# Altium schematic sheet POWER_GEN.SchDoc: =project_title
size Tabloid; CompanyName: Luxonis Holding; Organization: Luxonis Holding; Address1: 1925 Harmony Park Drive; Address2: Westminster, CO; Address3: 80234; Address4: United States; SheetNumber: 11; SheetTotal: 13
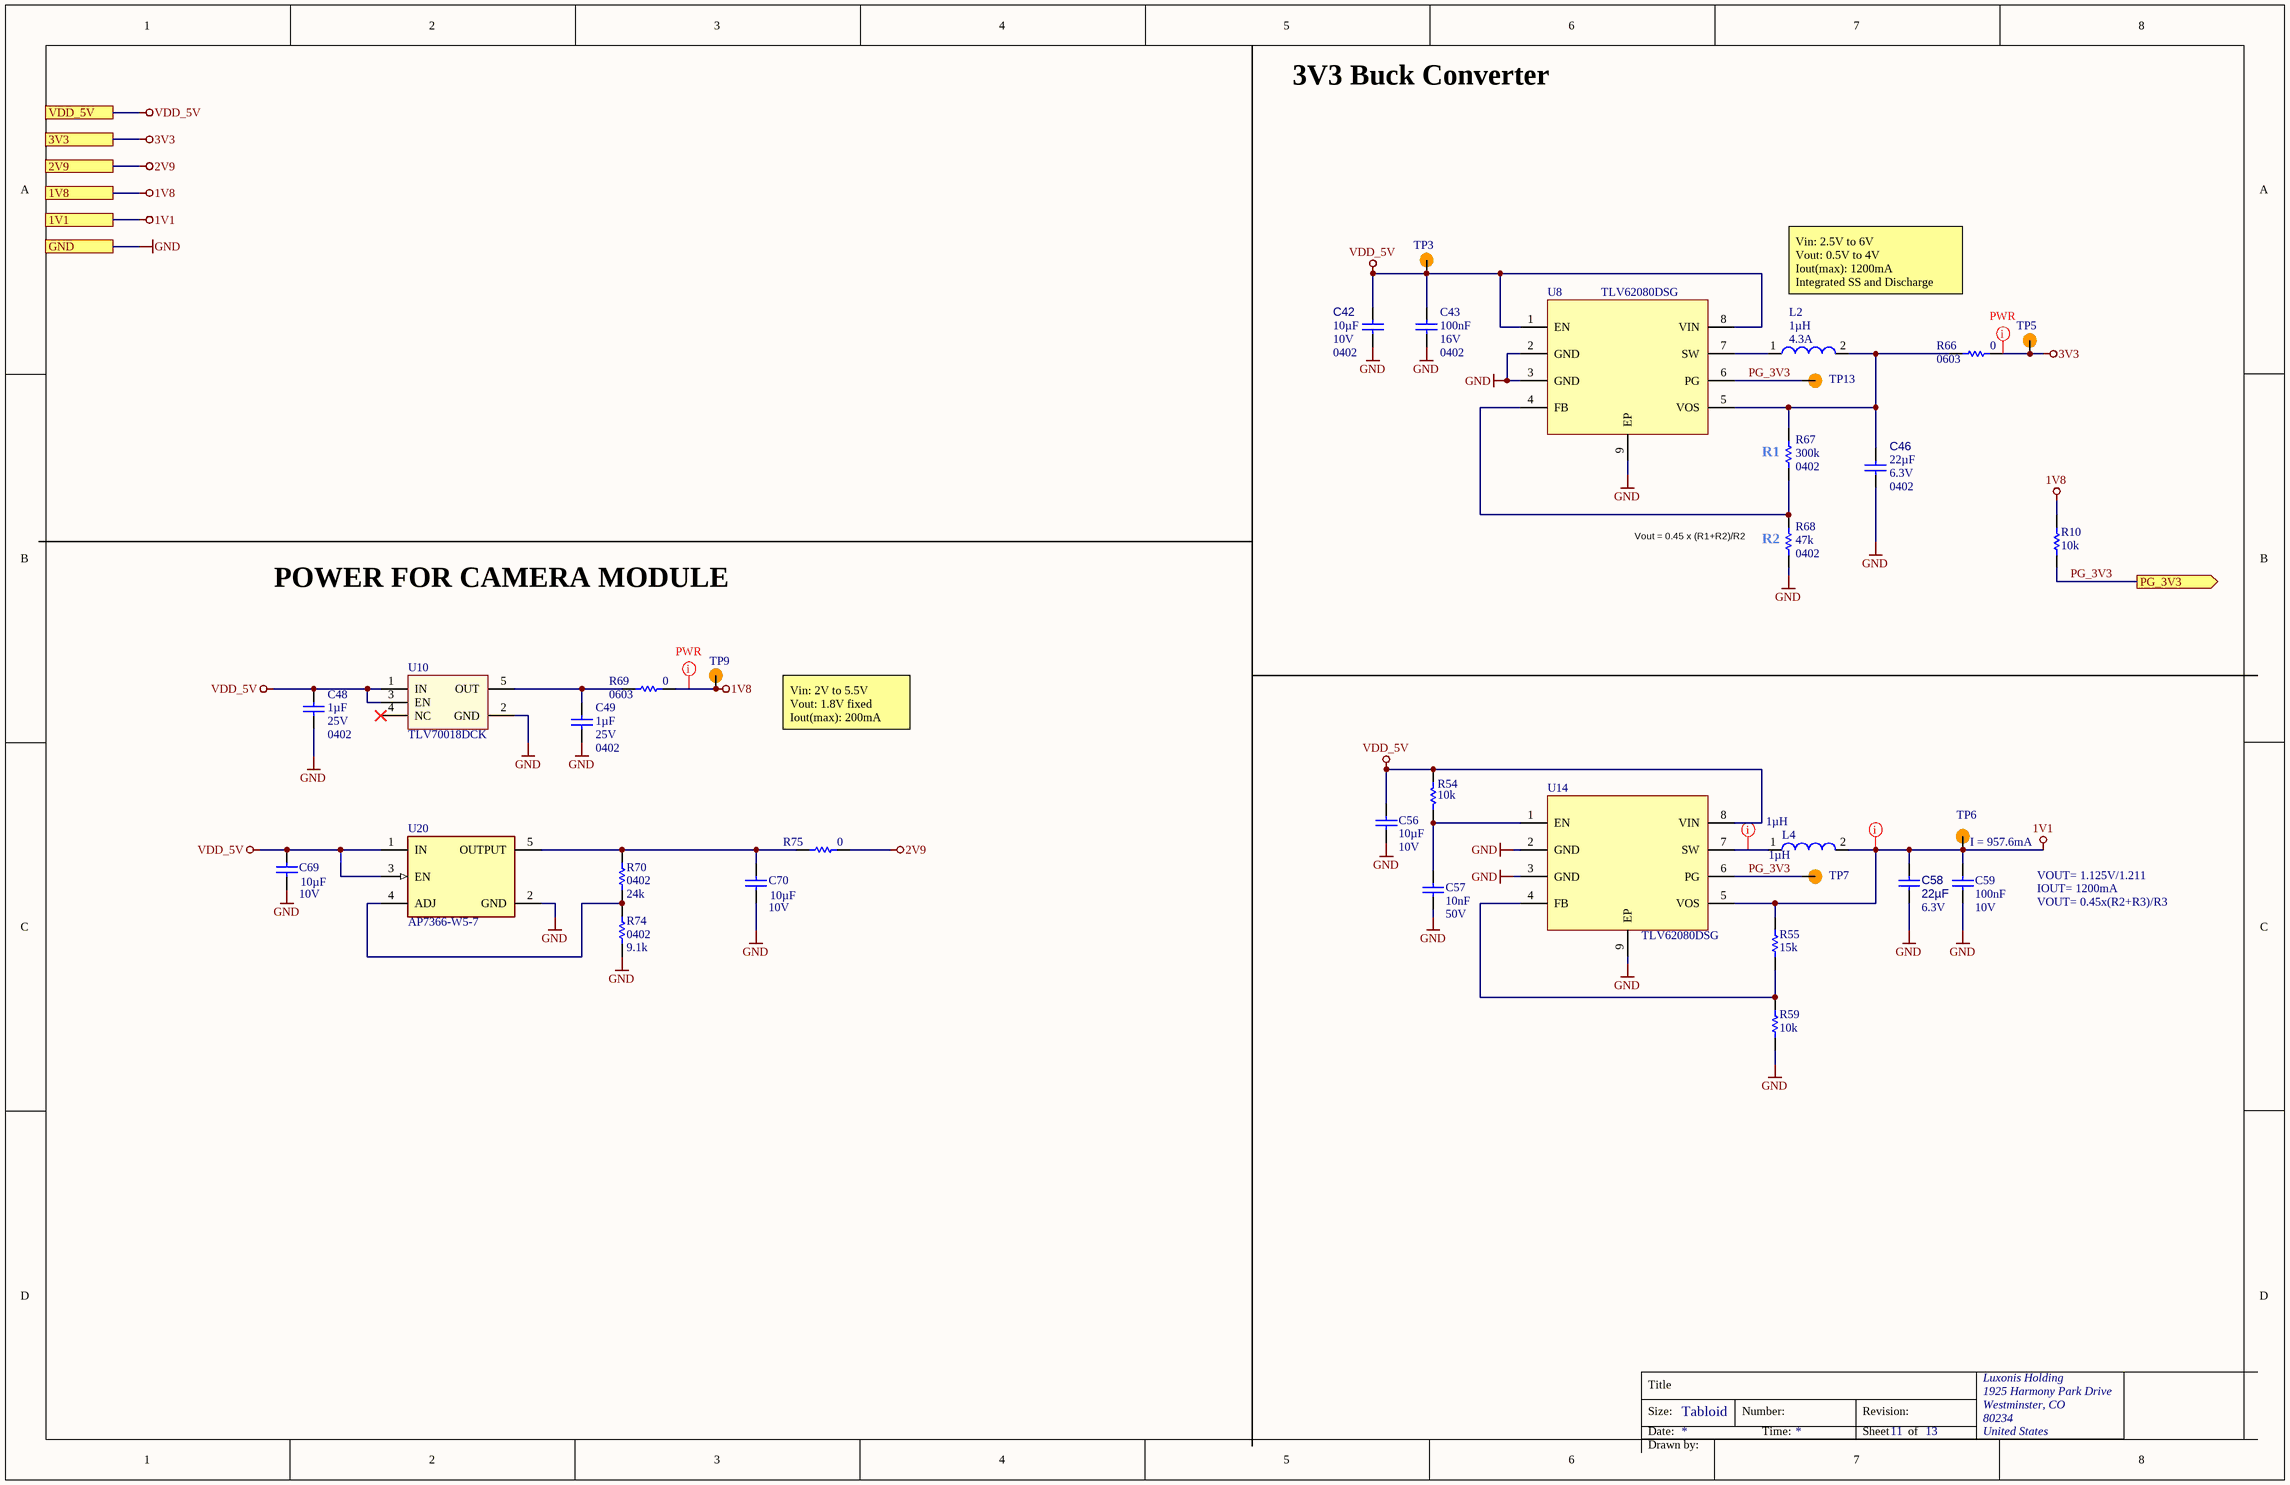
[diagram p0: POWER_GEN.SchDoc]

## Parts
C42  value 10µF  Voltage Rating: 10V  Case/Package: 0402  [CAPC0402(1005)60_L]  (hidden comment: GRM155R61A106ME11D)
C43  value 100nF  Voltage Rating: 16V  Case/Package: 0402  [CAPC0402(1005)60_N]  (hidden comment: CL05B104KO5NFNC)
C46  value 22µF  Voltage Rating: 6.3V  Case/Package: 0402  [CAPC0402(1005)60_L]  (hidden comment: CL05A226MQ5N6J8)
C48  value 1µF  Voltage Rating: 25V  Case/Package: 0402  [CAPC0402(1005)70_N]  (hidden comment: GRM155R61E105KA12D)
C49  value 1µF  Voltage Rating: 25V  Case/Package: 0402  [CAPC0402(1005)70_N]  (hidden comment: GRM155R61E105KA12D)
C56  10µF  Voltage Rating: 10V  [CAPC0603(1608)100_L]
C57  10nF  Voltage Rating: 50V  [CAPC0402(1005)60_L]
C58  22µF  Voltage Rating: 6.3V  [CAPC0402(1005)60_L]
C59  100nF  Voltage Rating: 10V  [CAPC0402(1005)70_L]
C69  value 10µF  Voltage Rating: 10V  [CAPC0603(1608)100_L]  (hidden comment: GRM188R61A106ME69D)
C70  value 10µF  Voltage Rating: 10V  [CAPC0603(1608)100_L]  (hidden comment: GRM188R61A106ME69D)
L2  value 1µH  Current Rating: 4.3A  [DFE252012P-1R0M=P2]  (hidden comment: DFE252012P-1R0M=P2)
L4  1µH  [DFE252012P-1R0M=P2]
R10  10k  [RESC0402(1005)_L]
R54  10k  [RESC0402(1005)_L]
R55  15k  [RESC0402(1005)_L]
R59  10k  [RESC0402(1005)_L]
R66  value 0  Case/Package: 0603  [RESC0603(1608)_N]  (hidden comment: CRCW06030000Z0EA)
R67  value 300k  Case/Package: 0402  [RESC0402(1005)_N]  (hidden comment: RC0402FR-07300KL)
R68  value 47k  Case/Package: 0402  [RESC0402(1005)_L]  (hidden comment: RC0402FR-0747KL)
R69  value 0  Case/Package: 0603  [RESC0603(1608)_N]  (hidden comment: CRCW06030000Z0EA)
R70  value 24k  Case/Package: 0402  [RESC0402(1005)_L]  (hidden comment: RC0402FR-0724KL)
R74  value 9.1k  Case/Package: 0402  [RESC0402(1005)_L]  (hidden comment: CRCW04029K10FKED)
R75  value 0  [RESC0603(1608)_N]  (hidden comment: CRCW06030000Z0EA)
TP3  TEST_POINT  [TP075_150_NS]  (value not drawn)  (no BOM)
TP5  TEST_POINT  [TP075_150_NS]  (value not drawn)  (no BOM)
TP6  TEST_POINT  [TP075_150_NS]  (value not drawn)  (no BOM)
TP7  TEST_POINT  [TP075_150_NS]  (value not drawn)  (no BOM)
TP9  TEST_POINT  [TP075_150_NS]  (value not drawn)  (no BOM)
TP13  TEST_POINT  [TP075_150_NS]  (value not drawn)  (no BOM)
U8  TLV62080DSG  [TLV62080DSG]
U10  TLV70018DCK  [TLV70018DCK]
U14  TLV62080DSG  [TLV62080DSG]
U20  AP7366-W5-7  [FP-SOT25-MFG]

## Ports
1V1, 1V8, 2V9, 3V3, GND, PG_3V3 (out), VDD_5V

## Nets
1V1: C58.2 C59.2 L4.2 R55.2 TP6.1 U14.5(VOS) ; port 1V1
1V8: R10.2 R69.2 TP9.1 ; port 1V8
2V9: R75.2 ; port 2V9
3V3: R66.2 TP5.1 ; port 3V3
GND: C42.1 C43.1 C46.1 C48.1 C49.1 C56.1 C57.1 C58.1 C59.1 C69.1 C70.1 R59.1 R68.1 R74.1 U8.2(GND) U8.3(GND) U8.9(EP) U10.2(GND) U14.2(GND) U14.3(GND) U14.9(EP) U20.2(GND) ; port GND
VDD_5V: C42.2 C43.2 C48.2 C56.2 C69.2 R54.2 TP3.1 U8.1(EN) U8.8(VIN) U10.1(IN) U10.3(EN) U14.8(VIN) U20.1(IN) U20.3(EN) ; port VDD_5V
PG_3V3: R10.1 TP7.1 TP13.1 U8.6(PG) U14.6(PG) ; port PG_3V3
NetC46_2: C46.2 L2.2 R66.1 R67.2 U8.5(VOS)
NetC49_2: C49.2 R69.1 U10.5(OUT)
NetC57_2: C57.2 R54.1 U14.1(EN)
NetC70_2: C70.2 R70.2 R75.1 U20.5(OUTPUT)
NetL2_1: L2.1 U8.7(SW)
NetL4_1: L4.1 U14.7(SW)
NetR55_1: R55.1 R59.2 U14.4(FB)
NetR67_1: R67.1 R68.2 U8.4(FB)
NetR70_1: R70.1 R74.2 U20.4(ADJ)

Not connected (* = marked no-connect by the designer): U10 4(NC)*

## Layout directives
net class PWR; Current Rating: 1200mA: 3V3
net class Power_trace: 1V1, NetL4_1
net class PWR; Current Rating: 300mA: 1V8

## Notes on the sheet
- 3V3 Buck Converter
- Vin: 2.5V to 6V
  Vout: 0.5V to 4V
  Iout(max): 1200mA
  Integrated SS and Discharge
- (near R67) R1
- (near R68) Vout = 0.45 x (R1+R2)/R2
- (near R68) R2
- POWER FOR CAMERA MODULE
- Vin: 2V to 5.5V
  Vout: 1.8V fixed
  Iout(max): 200mA
- (near TP6) I = 957.6mA
- VOUT= 1.125V/1.211
- IOUT= 1200mA
- VOUT= 0.45x(R2+R3)/R3
- Title
- Size:
- Date:
- Tabloid
- Number:
- Time:
- Revision:
- Sheet
- of
- Drawn by:

## Library data of the parts
C42 = CMP-001-00125-4: CAP CER 10UF 10V X5R 0402 20%; Manufacturer 1: Murata; Mounting Technology: SMT; Tolerance: 20%; Manufacturer Part Number 1: GRM155R61A106ME11D; Dielectric: X5R
C43 = CMP-108-000002-6: CAP CER 0.1UF 16V X7R 0402 10%; Manufacturer 1: Samsung; ComponentLink1URL: https://datasheet.ciiva.com/25767/cl05b104ko5nfnc-25767124.pdf?src-supplier=Digi-Key; Length: 1mm; Design Item ID: CL05B104KO5NFNC; Tolerance: 10%; Min Operating Temperature: -55°C; Width: 0.02inch; Dielectric: X7R; ComponentLink1Description: https://datasheet.ciiva.com/25767/cl05b104ko5nfnc-25767124.pdf?src-supplier=Digi-Key; Height: 0.5mm; Depth: 0.5mm; Manufacturer Part Number 1: CL05B104KO5NFNC; Max Operating Temperature: 125°C; Mounting Technology: SMT
C46 = CMP-001-00163-4: CAP CER 22UF 6.3V X5R 0402 20%; Manufacturer 1: Samsung; Manufacturer Part Number 1: CL05A226MQ5N6J8; Mounting Technology: Surface Mount; Tolerance: 20%
C48 C49 = CMP-108-000014-5: CAP CER 1UF 25V X5R 0402 10%; Manufacturer 1: Murata; ComponentLink2Description: https://datasheet.ciiva.com/7719/1666664-7719006.pdf?src-supplier=Element14; ComponentLink2URL: https://datasheet.ciiva.com/7719/1666664-7719006.pdf?src-supplier=Element14; Max Operating Temperature: 85°C; Depth: 0.5mm; Mounting Technology: SMT; ComponentLink1URL: https://datasheet.ciiva.com/22732/1666664-22732122.pdf?src-supplier=Element14; Length: 1mm; ComponentLink1Description: https://datasheet.ciiva.com/22732/1666664-22732122.pdf?src-supplier=Element14; Manufacturer Part Number 1: GRM155R61E105KA12D; Tolerance: 10%; Design Item ID: GRM155R61E105KA12D; Dielectric: X5R; Min Operating Temperature: -55°C; Height: 0.5mm; Width: 0.5mm
C56 = CMP-004-000018-4: CAP CER 10UF 10V X5R 0603 20%; Manufacturer 1: Murata; Manufacturer Part Number 1: GRM188R61A106ME69D; Case/Package: 0603; Min Operating Temperature: -55°C; Max Operating Temperature: 85°C; Tolerance: 20%; Dielectric: X5R; Length: 1.6mm; Height: 0.8mm; Width: 0.8mm; Depth: 0.8mm; ComponentLink1URL: http://www.mouser.com/ds/2/281/c02e-2905.pdf?src-supplier=Mouser; ComponentLink1Description: http://www.mouser.com/ds/2/281/c02e-2905.pdf?src-supplier=Mouser; ComponentLink2URL: http://components.arrow.com/part/dataview/0323_06119472?src-supplier=Arrow+Europe; ComponentLink2Description: http://components.arrow.com/part/dataview/0323_06119472?src-supplier=Arrow+Europe; ComponentLink3URL: http://www.farnell.com/datasheets/2048014.pdf?src-supplier=Farnell; ComponentLink3Description: http://www.farnell.com/datasheets/2048014.pdf?src-supplier=Farnell; ComponentLink4URL: http://www.farnell.com/datasheets/1872210.pdf?src-supplier=Farnell; ComponentLink4Description: http://www.farnell.com/datasheets/1872210.pdf?src-supplier=Farnell; ComponentLink5URL: http://search.murata.co.jp/Ceramy/image/img/A01X/G101/ENG/GRM188R61A106ME69-01.pdf?src-supplier=Digi-Key; ComponentLink5Description: http://search.murata.co.jp/Ceramy/image/img/A01X/G101/ENG/GRM188R61A106ME69-01.pdf?src-supplier=Digi-Key; ComponentLink6URL: http://www.farnell.com/datasheets/1872210.pdf?src-supplier=Newark; ComponentLink6Description: http://www.farnell.com/datasheets/1872210.pdf?src-supplier=Newark; ComponentLink7URL: http://www.farnell.com/datasheets/2048014.pdf?src-supplier=Element14; ComponentLink7Description: http://www.farnell.com/datasheets/2048014.pdf?src-supplier=Element14; ComponentLink8URL: http://www.farnell.com/datasheets/2048014.pdf?src-supplier=Newark; ComponentLink8Description: http://www.farnell.com/datasheets/2048014.pdf?src-supplier=Newark; Design Item ID: GRM188R61A106ME69D; Mounting Technology: SMT; Value: 10µF
C57 = CMP-108-000016-6: CAP CER 10000PF 50V X7R 0402 10%; Manufacturer 1: Murata; Manufacturer Part Number 1: GRM155R71H103KA88D; Case/Package: 0402; Min Operating Temperature: -55°C; Max Operating Temperature: 125°C; Tolerance: 10%; Dielectric: X7R; Length: 1mm; Height: 0.5mm; Width: 0.02inch; Depth: 0.5mm; ComponentLink1URL: https://datasheet.ciiva.com/129/product-129810.pdf?src-supplier=Digi-Key; ComponentLink1Description: https://datasheet.ciiva.com/129/product-129810.pdf?src-supplier=Digi-Key; ComponentLink2URL: https://datasheet.ciiva.com/19476/1856433-19476546.pdf?src-supplier=Jameco; ComponentLink2Description: https://datasheet.ciiva.com/19476/1856433-19476546.pdf?src-supplier=Jameco; ComponentLink3URL: https://datasheet.ciiva.com/11786/0900766b80ef921d-11786340.pdf?src-supplier=RSComponents; ComponentLink3Description: https://datasheet.ciiva.com/11786/0900766b80ef921d-11786340.pdf?src-supplier=RSComponents; ComponentLink4URL: https://datasheet.ciiva.com/18100/getdatasheetpartid-27434-18100660.pdf?src-supplier=Verical; ComponentLink4Description: https://datasheet.ciiva.com/18100/getdatasheetpartid-27434-18100660.pdf?src-supplier=Verical; ComponentLink5URL: https://datasheet.ciiva.com/22698/1747449-22698420.pdf?src-supplier=Element14; ComponentLink5Description: https://datasheet.ciiva.com/22698/1747449-22698420.pdf?src-supplier=Element14; ComponentLink6URL: https://datasheet.ciiva.com/29199/454225-da-01-en-vs-kondensator-0402-29199740.pdf?src-supplier=Conrad; ComponentLink6Description: https://datasheet.ciiva.com/29199/454225-da-01-en-vs-kondensator-0402-29199740.pdf?src-supplier=Conrad; ComponentLink7URL: https://datasheet.ciiva.com/129/grm155r71h103ka88-01-129811.pdf?src-supplier=Digi-Key; ComponentLink7Description: https://datasheet.ciiva.com/129/grm155r71h103ka88-01-129811.pdf?src-supplier=Digi-Key; ComponentLink8URL: https://datasheet.ciiva.com/129/grm155r71h103ka88-01-129812.pdf?src-supplier=Digi-Key; ComponentLink8Description: https://datasheet.ciiva.com/129/grm155r71h103ka88-01-129812.pdf?src-supplier=Digi-Key; ComponentLink9URL: https://datasheet.ciiva.com/16495/product-16495290.pdf?src-supplier=Future+Electronics; ComponentLink9Description: https://datasheet.ciiva.com/16495/product-16495290.pdf?src-supplier=Future+Electronics; ComponentLink10URL: https://datasheet.ciiva.com/5410/product-5410990.pdf?src-supplier=Mouser; ComponentLink10Description: https://datasheet.ciiva.com/5410/product-5410990.pdf?src-supplier=Mouser; Design Item ID: GRM155R71H103KA88D; Mounting Technology: SMT; Value: 10nF
C58 = CMP-001-00163-4: CAP CER 22UF 6.3V X5R 0402 20%; Manufacturer 1: Samsung; Manufacturer Part Number 1: CL05A226MQ5N6J8; Case/Package: 0402; Tolerance: 20%; Mounting Technology: Surface Mount; Value: 22µF
C59 = CMP-108-000015-5: CAP CER 0.1UF 10V X7R 0402 5%; Manufacturer 1: Murata; Manufacturer Part Number 1: GRM155R71A104JA01D; Case/Package: 0402; Min Operating Temperature: -55°C; Max Operating Temperature: 125°C; Tolerance: 5%; Dielectric: X7R; Length: 1mm; Height: 0.5mm; Width: 0.02inch; Depth: 0.5mm; ComponentLink1URL: https://datasheet.ciiva.com/5411/product-5411135.pdf?src-supplier=Mouser; ComponentLink1Description: https://datasheet.ciiva.com/5411/product-5411135.pdf?src-supplier=Mouser; ComponentLink2URL: https://datasheet.ciiva.com/11618/c02e-11618821.pdf?src-supplier=Avnet; ComponentLink2Description: https://datasheet.ciiva.com/11618/c02e-11618821.pdf?src-supplier=Avnet; Design Item ID: GRM155R71A104JA01D; Mounting Technology: SMT; Value: 100nF
C69 C70 = CMP-004-000018-4: CAP CER 10UF 10V X5R 0603 20%; Manufacturer 1: Murata; Manufacturer Part Number 1: GRM188R61A106ME69D; Case/Package: 0603; Min Operating Temperature: -55°C; Max Operating Temperature: 85°C; Tolerance: 20%; Dielectric: X5R; Length: 1.6mm; Height: 0.8mm; Width: 0.8mm; Depth: 0.8mm; ComponentLink1URL: http://www.mouser.com/ds/2/281/c02e-2905.pdf?src-supplier=Mouser; ComponentLink1Description: http://www.mouser.com/ds/2/281/c02e-2905.pdf?src-supplier=Mouser; ComponentLink2URL: http://components.arrow.com/part/dataview/0323_06119472?src-supplier=Arrow+Europe; ComponentLink2Description: http://components.arrow.com/part/dataview/0323_06119472?src-supplier=Arrow+Europe; ComponentLink3URL: http://www.farnell.com/datasheets/2048014.pdf?src-supplier=Farnell; ComponentLink3Description: http://www.farnell.com/datasheets/2048014.pdf?src-supplier=Farnell; ComponentLink4URL: http://www.farnell.com/datasheets/1872210.pdf?src-supplier=Farnell; ComponentLink4Description: http://www.farnell.com/datasheets/1872210.pdf?src-supplier=Farnell; ComponentLink5URL: http://search.murata.co.jp/Ceramy/image/img/A01X/G101/ENG/GRM188R61A106ME69-01.pdf?src-supplier=Digi-Key; ComponentLink5Description: http://search.murata.co.jp/Ceramy/image/img/A01X/G101/ENG/GRM188R61A106ME69-01.pdf?src-supplier=Digi-Key; ComponentLink6URL: http://www.farnell.com/datasheets/1872210.pdf?src-supplier=Newark; ComponentLink6Description: http://www.farnell.com/datasheets/1872210.pdf?src-supplier=Newark; ComponentLink7URL: http://www.farnell.com/datasheets/2048014.pdf?src-supplier=Element14; ComponentLink7Description: http://www.farnell.com/datasheets/2048014.pdf?src-supplier=Element14; ComponentLink8URL: http://www.farnell.com/datasheets/2048014.pdf?src-supplier=Newark; ComponentLink8Description: http://www.farnell.com/datasheets/2048014.pdf?src-supplier=Newark; Design Item ID: GRM188R61A106ME69D; Mounting Technology: SMT
L2 = CMP-082-000001-2: FIXED IND 1UH 3.2A 42 MOHM SMD; Manufacturer: Murata; Tolerance: 20%; Manufacturer Part Number: DFE252012P-1R0M=P2; Case/Package: 1008; Manufacturer 1: Murata; Manufacturer Part Number 1: DFE252012P-1R0M=P2; Manufacturer 2: Murata; Manufacturer Part Number 2: DFE252012P-1R0M=P2; Manufacturer 3: Murata; Manufacturer Part Number 3: DFE252012P-1R0M=P2; Manufacturer 4: Murata; Manufacturer Part Number 4: DFE252012P-1R0M=P2
L4 = CMP-082-000001-2: FIXED IND 1UH 3.2A 42 MOHM SMD; Manufacturer 1: Murata; Current Rating: 4.3A; Tolerance: 20%; Case/Package: 1008; Manufacturer Part Number 1: DFE252012P-1R0M=P2; Manufacturer 2: Murata; Manufacturer Part Number 2: DFE252012P-1R0M=P2; Manufacturer 3: Murata; Manufacturer Part Number 3: DFE252012P-1R0M=P2; Manufacturer 4: Murata; Manufacturer Part Number 4: DFE252012P-1R0M=P2; Manufacturer: Murata; Manufacturer Part Number: DFE252012P-1R0M=P2; Value: 1µH
R10 R54 R59 = CMP-115-000004-8: RES SMD 10K OHM 1% 1/16W 0402; Manufacturer 1: Yageo; Manufacturer Part Number 1: RC0402FR-1310KL; Temperature Coefficient: 100ppm/°C; Power Rating: 62.5mW; Voltage Rating: 50V; Case/Package: 0402; Min Operating Temperature: -55°C; Max Operating Temperature: 155°C; Tolerance: 1%; Design Item ID: RC0402FR-1310KL; Value: 10k
R55 = CMP-013-000009-9: RES SMD 15K OHM 1% 1/16W 0402; Manufacturer 1: Yageo; Manufacturer Part Number 1: RC0402FR-0715KL; Power Rating: 62.5mW; Voltage Rating: 50V; Case/Package: 0402; Min Operating Temperature: -55°C; Max Operating Temperature: 155°C; Tolerance: 1%; Design Item ID: RC0402FR-0715KL; Value: 15k
R66 R69 R75 = CMP-115-000011-7: RES SMD 0 OHM 5% 1/10W 0603; Manufacturer 1: Vishay; Manufacturer Part Number 1: CRCW0603-0000Z0EA; Temperature Coefficient: 100ppm/°C; Power Rating: 100mW; Voltage Rating: 75V; Tolerance: 5%; Design Item ID: CRCW06030000Z0EA; Max Operating Temperature: 155°C; Min Operating Temperature: -55°C
  R75: Case/Package: 0603
R67 = CMP-013-000049-8: RES SMD 300K OHM 1% 1/16W 0402; Manufacturer 1: Yageo; Voltage Rating: 50V; Power Rating: 63mW; Tolerance: 1%; Design Item ID: RC0402FR-07300KL; Max Operating Temperature: 155°C; Manufacturer Part Number 1: RC0402FR-07300KL; Min Operating Temperature: -55°C
R68 = CMP-013-000015-9: RES SMD 47K OHM 1% 1/16W 0402; Manufacturer 1: Yageo; Power Rating: 62.5mW; Voltage Rating: 50V; Max Operating Temperature: 155°C; Tolerance: 1%; Min Operating Temperature: -55°C; Manufacturer Part Number 1: RC0402FR-0747KL; Design Item ID: RC0402FR-0747KL
R70 = CMP-009-00213-16: RES SMD 24K OHM 1% 1/16W 0402; Manufacturer 1: YAGEO; Power Rating: 62.5mW; Manufacturer Part Number 1: RC0402FR-0724KL; Tolerance: 1%
R74 = CMP-00048-2: RES SMD 9.1K OHM 1% 1/16W 0402; Manufacturer 1: Vishay; Temperature Coefficient: 100ppm/°C; Package Width: 0.5mm; Power: 63mW; Package Length: 1mm; Reference Standard: AEC-Q200; Package Height: 0.35mm; Rated Temperature: 70°C; Working Voltage: 50V; Resistor Type: FIXED RESISTOR; Min Operating Temperature: -55°C; Reach SVHC Compliant: Yes; Max Operating Temperature: 155°C; Package Style: SMTMeter; Packaging: Tape and Reel; JESD-609 Code: e3; Mounting Technology: Surface Mount; Terminal Finish: Nickel; Construction: Chip; Manufacturer Part Number 1: CRCW04029K10FKED; Tolerance: 1%; Package Shape: Rectangular; Technology: METAL GLAZE/THICK FILM; Pins: 2; RoHS Compliant: Yes; Termination: Wraparound
TP3 TP5-TP7 TP9 TP13 = CMP-015-000000-5: Manufacturer Part Number 1: /; Design Item ID: TEST_POINT; Source: LuxonisMaster.SchLib
U8 = CMP-010-000007-4: IC REG BUCK ADJ 1.2A SYNC 8WSON; Manufacturer Part Number 1: TLV62080DSGR; Manufacturer 1: Texas Instruments; Output Voltage: 4V; Min Output Voltage: 500mV; Max Supply Voltage: 5.5V; Min Supply Voltage: 2.5V; Vfb/Vout: 450mV; Max Input Voltage: 6V; Max Output Current: 1.2A; Max Operating Temperature: 125°C; Max Output Voltage: 4V; Min Operating Temperature: -40°C; Min Input Voltage: 2.5V
U10 = CMP-113-000003-2: IC REG LINEAR 1.8V 200MA SC70-5 Linear Voltage Regulator IC  1 Output  200mA SC-70-5; Manufacturer 1: Texas Instruments; Manufacturer Part Number 1: TLV70018DCKR; Max Supply Voltage: 5.5V; Min Supply Voltage: 2V; Min Operating Temperature: -40°C; Pins: 5; Max Output Voltage: 1.8V; Max Operating Temperature: 125°C; Case/Package: SC; Max Output Current: 200mA; Min Output Voltage: 1.8V
U14 = CMP-010-000007-4: IC REG BUCK ADJ 1.2A SYNC 8WSON; Manufacturer 1: Texas Instruments; Manufacturer Part Number 1: TLV62080DSGR; Output Voltage: 4V; Min Supply Voltage: 2.5V; Min Output Voltage: 500mV; Max Supply Voltage: 5.5V; Vfb/Vout: 450mV; Max Input Voltage: 6V; Min Operating Temperature: -40°C; Max Operating Temperature: 125°C; Max Output Current: 1.2A; Max Output Voltage: 4V; Min Input Voltage: 2.5V
U20 = CMP-019-00055-5: Adjustable Positive LDO Regulator, 0.8V Min, 5V Max, PDSO5; Manufacturer 1: Diodes; Output Voltage: 800mV; Min Supply Voltage: 2.2V; Output Current: 600mA; Max Supply Voltage: 6V; Manufacturer part number 1: AP7366-W5-7; Pins: 5; Max Input Voltage: 6V; Vfb/Vout: 800mV; Max Output Current: 600mA; Min Input Voltage: 2.2V